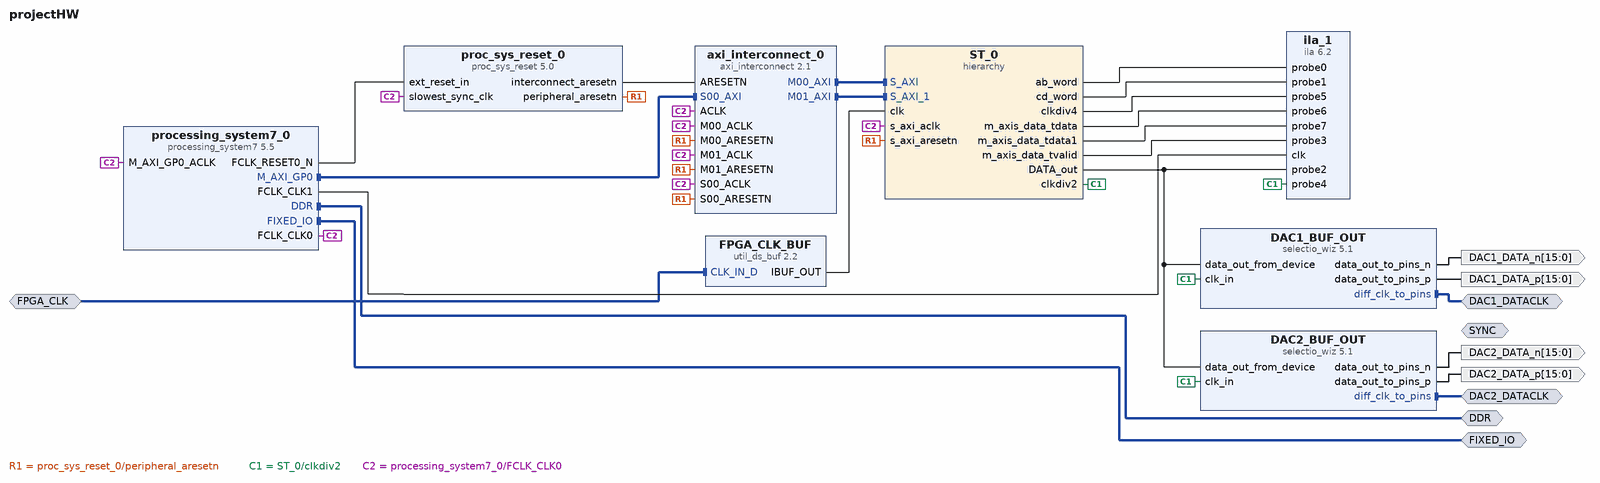
[diagram p0: block diagram of the top level]
# Vivado block design projectHW, xc7z020clg400-1, Vivado 2021.1
create_bd_design projectHW

create_bd_intf_port -mode Master -vlnv xilinx.com:interface:diff_clock_rtl:1.0 DAC1_DATACLK
create_bd_intf_port -mode Master -vlnv xilinx.com:interface:diff_clock_rtl:1.0 DAC2_DATACLK
create_bd_intf_port -mode Master -vlnv xilinx.com:interface:ddrx_rtl:1.0 DDR
create_bd_intf_port -mode Master -vlnv xilinx.com:display_processing_system7:fixedio_rtl:1.0 FIXED_IO
create_bd_intf_port -mode Slave -vlnv xilinx.com:interface:diff_clock_rtl:1.0 FPGA_CLK
create_bd_intf_port -mode Master -vlnv xilinx.com:interface:diff_clock_rtl:1.0 SYNC
create_bd_port -dir O -from 15 -to 0 DAC1_DATA_n
create_bd_port -dir O -from 15 -to 0 DAC1_DATA_p
create_bd_port -dir O -from 15 -to 0 DAC2_DATA_n
create_bd_port -dir O -from 15 -to 0 DAC2_DATA_p

create_bd_cell -type ip -vlnv xilinx.com:ip:selectio_wiz:5.1 DAC1_BUF_OUT
set_property -dict [list \
  CONFIG.BUS_DIR OUTPUTS \
  CONFIG.BUS_IO_STD LVDS_25 \
  CONFIG.BUS_SIG_TYPE DIFF \
  CONFIG.CLK_FWD true \
  CONFIG.CLK_FWD_IO_STD LVDS_25 \
  CONFIG.CLK_FWD_SIG_TYPE DIFF \
  CONFIG.SELIO_ACTIVE_EDGE DDR \
  CONFIG.SELIO_BUS_IN_DELAY NONE \
  CONFIG.SELIO_CLK_BUF MMCM \
  CONFIG.SELIO_CLK_IO_STD LVDS_25 \
  CONFIG.SELIO_CLK_SIG_TYPE DIFF \
  CONFIG.SELIO_INTERFACE_TYPE NETWORKING \
  CONFIG.SERIALIZATION_FACTOR 4 \
  CONFIG.SYSTEM_DATA_WIDTH 16 \
] [get_bd_cells DAC1_BUF_OUT]
create_bd_cell -type ip -vlnv xilinx.com:ip:selectio_wiz:5.1 DAC2_BUF_OUT
set_property -dict [list \
  CONFIG.BUS_DIR OUTPUTS \
  CONFIG.BUS_IO_STD LVDS_25 \
  CONFIG.BUS_SIG_TYPE DIFF \
  CONFIG.CLK_FWD true \
  CONFIG.CLK_FWD_IO_STD LVDS_25 \
  CONFIG.CLK_FWD_SIG_TYPE DIFF \
  CONFIG.CONFIG_CLK_FWD true \
  CONFIG.SELIO_ACTIVE_EDGE DDR \
  CONFIG.SELIO_BUS_IN_DELAY NONE \
  CONFIG.SELIO_CLK_BUF MMCM \
  CONFIG.SELIO_CLK_IO_STD LVDS_25 \
  CONFIG.SELIO_CLK_SIG_TYPE DIFF \
  CONFIG.SELIO_INTERFACE_TYPE NETWORKING \
  CONFIG.SERIALIZATION_FACTOR 4 \
  CONFIG.SYSTEM_DATA_WIDTH 16 \
] [get_bd_cells DAC2_BUF_OUT]
create_bd_cell -type ip -vlnv xilinx.com:ip:util_ds_buf:2.2 FPGA_CLK_BUF
create_bd_cell -type hier ST_0
create_bd_cell -type ip -vlnv xilinx.com:ip:axi_interconnect:2.1 axi_interconnect_0
set_property -dict {CONFIG.NUM_MI 2} [get_bd_cells axi_interconnect_0]
create_bd_cell -type ip -vlnv xilinx.com:ip:ila:6.2 ila_1
set_property -dict [list \
  CONFIG.ALL_PROBE_SAME_MU false \
  CONFIG.C_DATA_DEPTH 8192 \
  CONFIG.C_ENABLE_ILA_AXI_MON false \
  CONFIG.C_MONITOR_TYPE Native \
  CONFIG.C_NUM_OF_PROBES 8 \
  CONFIG.C_PROBE0_WIDTH 64 \
  CONFIG.C_PROBE1_WIDTH 64 \
  CONFIG.C_PROBE2_WIDTH 32 \
  CONFIG.C_PROBE4_WIDTH 1 \
  CONFIG.C_PROBE6_WIDTH 32 \
  CONFIG.C_PROBE7_WIDTH 32 \
] [get_bd_cells ila_1]
create_bd_cell -type ip -vlnv xilinx.com:ip:proc_sys_reset:5.0 proc_sys_reset_0
create_bd_cell -type ip -vlnv xilinx.com:ip:processing_system7:5.5 processing_system7_0
set_property -dict [list \
  CONFIG.PCW_APU_PERIPHERAL_FREQMHZ 666.666666 \
  CONFIG.PCW_ENET0_ENET0_IO {MIO 16 .. 27} \
  CONFIG.PCW_ENET0_GRP_MDIO_ENABLE 1 \
  CONFIG.PCW_ENET0_GRP_MDIO_IO {MIO 52 .. 53} \
  CONFIG.PCW_ENET0_PERIPHERAL_ENABLE 1 \
  CONFIG.PCW_ENET_RESET_ENABLE 0 \
  CONFIG.PCW_EN_CLK1_PORT 1 \
  CONFIG.PCW_FPGA0_PERIPHERAL_FREQMHZ 125 \
  CONFIG.PCW_FPGA1_PERIPHERAL_FREQMHZ 250 \
  CONFIG.PCW_FPGA_FCLK1_ENABLE 1 \
  CONFIG.PCW_GPIO_MIO_GPIO_ENABLE 1 \
  CONFIG.PCW_GPIO_MIO_GPIO_IO MIO \
  CONFIG.PCW_I2C_RESET_ENABLE 0 \
  CONFIG.PCW_PERIPHERAL_BOARD_PRESET part0 \
  CONFIG.PCW_PRESET_BANK1_VOLTAGE {LVCMOS 2.5V} \
  CONFIG.PCW_QSPI_GRP_FBCLK_ENABLE 1 \
  CONFIG.PCW_QSPI_GRP_FBCLK_IO {MIO 8} \
  CONFIG.PCW_QSPI_GRP_SINGLE_SS_ENABLE 1 \
  CONFIG.PCW_QSPI_GRP_SINGLE_SS_IO {MIO 1 .. 6} \
  CONFIG.PCW_QSPI_PERIPHERAL_ENABLE 1 \
  CONFIG.PCW_QSPI_QSPI_IO {MIO 1 .. 6} \
  CONFIG.PCW_SD0_GRP_CD_ENABLE 1 \
  CONFIG.PCW_SD0_GRP_CD_IO {MIO 46} \
  CONFIG.PCW_SD0_GRP_WP_ENABLE 1 \
  CONFIG.PCW_SD0_GRP_WP_IO {MIO 50} \
  CONFIG.PCW_SD0_PERIPHERAL_ENABLE 1 \
  CONFIG.PCW_SD0_SD0_IO {MIO 40 .. 45} \
  CONFIG.PCW_SDIO_PERIPHERAL_FREQMHZ 100 \
  CONFIG.PCW_SINGLE_QSPI_DATA_MODE x4 \
  CONFIG.PCW_UART1_PERIPHERAL_ENABLE 1 \
  CONFIG.PCW_UART1_UART1_IO {MIO 48 .. 49} \
  CONFIG.PCW_UART_PERIPHERAL_FREQMHZ 100 \
  CONFIG.PCW_UIPARAM_DDR_FREQ_MHZ 533.333333 \
  CONFIG.PCW_UIPARAM_DDR_PARTNO {MT41K256M16 RE-125} \
  CONFIG.PCW_USB0_PERIPHERAL_ENABLE 1 \
  CONFIG.PCW_USB0_USB0_IO {MIO 28 .. 39} \
  CONFIG.PCW_USB_RESET_ENABLE 0 \
] [get_bd_cells processing_system7_0]
# 499 more settings of processing_system7_0 are not shown: defaults, MIO pin electricals, DDR timing, and values the tool derives

# ---- hierarchy /ST_0 ----
current_bd_instance /ST_0
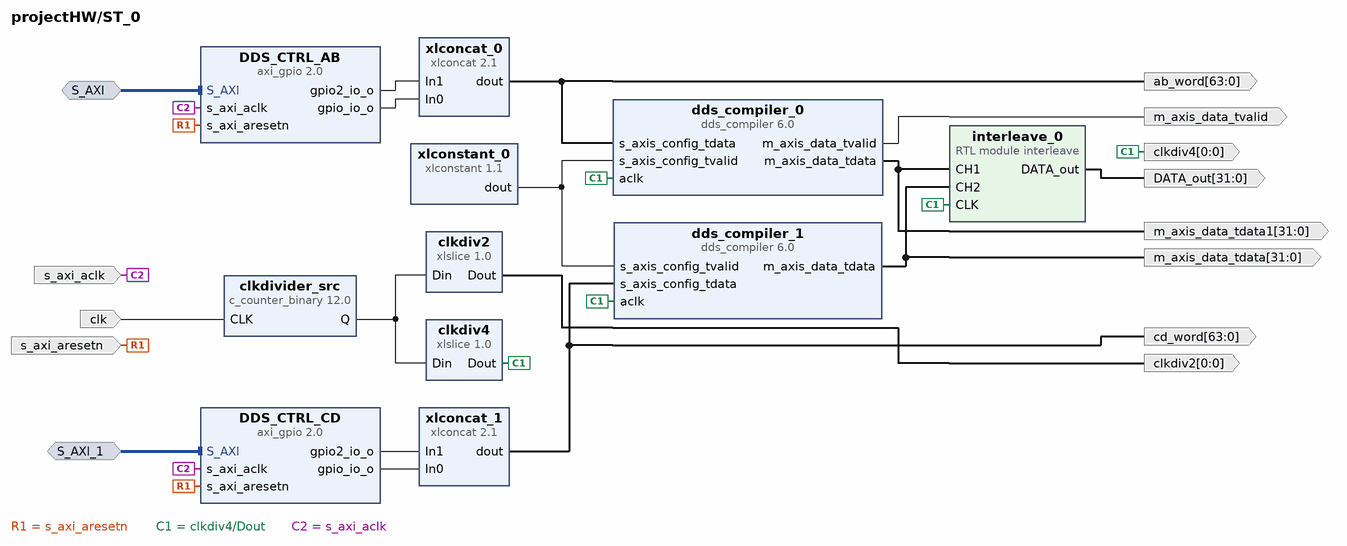
[diagram p1: block diagram inside /ST_0]
create_bd_intf_pin -mode Slave -vlnv xilinx.com:interface:aximm_rtl:1.0 S_AXI
create_bd_intf_pin -mode Slave -vlnv xilinx.com:interface:aximm_rtl:1.0 S_AXI_1
create_bd_pin -dir I -type clk s_axi_aclk
create_bd_pin -dir I -type rst s_axi_aresetn
create_bd_pin -dir I clk
create_bd_pin -dir O -from 0 -to 0 clkdiv2
create_bd_pin -dir O -from 0 -to 0 clkdiv4
create_bd_pin -dir O m_axis_data_tvalid
create_bd_pin -dir O -from 63 -to 0 cd_word
create_bd_pin -dir O -from 63 -to 0 ab_word
create_bd_pin -dir O -from 31 -to 0 DATA_out
create_bd_pin -dir O -from 31 -to 0 m_axis_data_tdata
create_bd_pin -dir O -from 31 -to 0 m_axis_data_tdata1

create_bd_cell -type ip -vlnv xilinx.com:ip:axi_gpio:2.0 DDS_CTRL_AB
set_property -dict [list \
  CONFIG.C_ALL_OUTPUTS 1 \
  CONFIG.C_ALL_OUTPUTS_2 1 \
  CONFIG.C_GPIO2_WIDTH 32 \
  CONFIG.C_IS_DUAL 1 \
] [get_bd_cells DDS_CTRL_AB]
create_bd_cell -type ip -vlnv xilinx.com:ip:dds_compiler:6.0 dds_compiler_0
set_property -dict [list \
  CONFIG.Channels 1 \
  CONFIG.DATA_Has_TLAST Not_Required \
  CONFIG.DDS_Clock_Rate 62.5 \
  CONFIG.Frequency_Resolution 0.4 \
  CONFIG.Has_Phase_Out false \
  CONFIG.Latency 8 \
  CONFIG.M_DATA_Has_TUSER Not_Required \
  CONFIG.M_PHASE_Has_TUSER Not_Required \
  CONFIG.Noise_Shaping None \
  CONFIG.Output_Frequency1 0 \
  CONFIG.Output_Width 16 \
  CONFIG.PINC1 0 \
  CONFIG.Parameter_Entry Hardware_Parameters \
  CONFIG.PartsPresent Phase_Generator_and_SIN_COS_LUT \
  CONFIG.Phase_Increment Programmable \
  CONFIG.Phase_Width 32 \
  CONFIG.Phase_offset Programmable \
  CONFIG.S_PHASE_Has_TUSER Not_Required \
] [get_bd_cells dds_compiler_0]
create_bd_cell -type ip -vlnv xilinx.com:ip:xlconcat:2.1 xlconcat_0
set_property -dict {CONFIG.IN0_WIDTH 32 CONFIG.IN1_WIDTH 32} [get_bd_cells xlconcat_0]
create_bd_cell -type ip -vlnv xilinx.com:ip:axi_gpio:2.0 DDS_CTRL_CD
set_property -dict [list \
  CONFIG.C_ALL_OUTPUTS 1 \
  CONFIG.C_ALL_OUTPUTS_2 1 \
  CONFIG.C_GPIO2_WIDTH 32 \
  CONFIG.C_IS_DUAL 1 \
] [get_bd_cells DDS_CTRL_CD]
create_bd_cell -type ip -vlnv xilinx.com:ip:xlconcat:2.1 xlconcat_1
set_property -dict {CONFIG.IN0_WIDTH 32 CONFIG.IN1_WIDTH 32} [get_bd_cells xlconcat_1]
create_bd_cell -type ip -vlnv xilinx.com:ip:xlconstant:1.1 xlconstant_0
create_bd_cell -type ip -vlnv xilinx.com:ip:c_counter_binary:12.0 clkdivider_src
set_property -dict {CONFIG.Output_Width 2} [get_bd_cells clkdivider_src]
create_bd_cell -type ip -vlnv xilinx.com:ip:xlslice:1.0 clkdiv2
set_property -dict {CONFIG.DIN_FROM 0 CONFIG.DIN_WIDTH 2 CONFIG.DOUT_WIDTH 1} [get_bd_cells clkdiv2]
create_bd_cell -type ip -vlnv xilinx.com:ip:xlslice:1.0 clkdiv4
set_property -dict {CONFIG.DIN_FROM 1 CONFIG.DIN_TO 1 CONFIG.DIN_WIDTH 2 CONFIG.DOUT_WIDTH 1} [get_bd_cells clkdiv4]
create_bd_cell -type ip -vlnv xilinx.com:ip:dds_compiler:6.0 dds_compiler_1
set_property -dict [list \
  CONFIG.Channels 1 \
  CONFIG.DATA_Has_TLAST Not_Required \
  CONFIG.DDS_Clock_Rate 62.5 \
  CONFIG.Frequency_Resolution 0.4 \
  CONFIG.Has_Phase_Out false \
  CONFIG.Latency 8 \
  CONFIG.M_DATA_Has_TUSER Not_Required \
  CONFIG.M_PHASE_Has_TUSER Not_Required \
  CONFIG.Noise_Shaping None \
  CONFIG.Output_Frequency1 0 \
  CONFIG.Output_Width 16 \
  CONFIG.PINC1 0 \
  CONFIG.Parameter_Entry Hardware_Parameters \
  CONFIG.PartsPresent Phase_Generator_and_SIN_COS_LUT \
  CONFIG.Phase_Increment Programmable \
  CONFIG.Phase_Width 32 \
  CONFIG.Phase_offset Programmable \
  CONFIG.S_PHASE_Has_TUSER Not_Required \
] [get_bd_cells dds_compiler_1]
create_bd_cell -type module -reference interleave interleave_0

# ---- connections ----

current_bd_instance /ST_0
connect_bd_intf_net -intf_net S_AXI_1_1 [get_bd_intf_pins S_AXI_1] [get_bd_intf_pins DDS_CTRL_CD/S_AXI]
connect_bd_intf_net -intf_net axi_interconnect_0_M00_AXI [get_bd_intf_pins S_AXI] [get_bd_intf_pins DDS_CTRL_AB/S_AXI]
connect_bd_net -net DAC2_CTRL_gpio2_io_o [get_bd_pins DDS_CTRL_AB/gpio2_io_o] [get_bd_pins xlconcat_0/In1]
connect_bd_net -net DAC2_CTRL_gpio_io_o [get_bd_pins DDS_CTRL_AB/gpio_io_o] [get_bd_pins xlconcat_0/In0]
connect_bd_net -net DDS_CTRL_AB1_gpio2_io_o [get_bd_pins DDS_CTRL_CD/gpio2_io_o] [get_bd_pins xlconcat_1/In1]
connect_bd_net -net DDS_CTRL_AB1_gpio_io_o [get_bd_pins DDS_CTRL_CD/gpio_io_o] [get_bd_pins xlconcat_1/In0]
connect_bd_net -net S00_ARESETN_1 [get_bd_pins s_axi_aresetn] [get_bd_pins DDS_CTRL_AB/s_axi_aresetn] [get_bd_pins DDS_CTRL_CD/s_axi_aresetn]
connect_bd_net [get_bd_pins clk] [get_bd_pins clkdivider_src/CLK]
connect_bd_net [get_bd_pins clkdiv2/Dout] [get_bd_pins clkdiv2]
connect_bd_net [get_bd_pins clkdiv4/Dout] \
  [get_bd_pins dds_compiler_0/aclk] [get_bd_pins dds_compiler_1/aclk] [get_bd_pins interleave_0/CLK] [get_bd_pins clkdiv4]
connect_bd_net [get_bd_pins clkdivider_src/Q] [get_bd_pins clkdiv2/Din] [get_bd_pins clkdiv4/Din]
connect_bd_net [get_bd_pins dds_compiler_0/m_axis_data_tdata] [get_bd_pins interleave_0/CH1] [get_bd_pins m_axis_data_tdata1]
connect_bd_net [get_bd_pins dds_compiler_0/m_axis_data_tvalid] [get_bd_pins m_axis_data_tvalid]
connect_bd_net [get_bd_pins dds_compiler_1/m_axis_data_tdata] [get_bd_pins interleave_0/CH2] [get_bd_pins m_axis_data_tdata]
connect_bd_net [get_bd_pins interleave_0/DATA_out] [get_bd_pins DATA_out]
connect_bd_net -net processing_system7_0_FCLK_CLK0 [get_bd_pins s_axi_aclk] [get_bd_pins DDS_CTRL_AB/s_axi_aclk] [get_bd_pins DDS_CTRL_CD/s_axi_aclk]
connect_bd_net [get_bd_pins xlconcat_0/dout] [get_bd_pins dds_compiler_0/s_axis_config_tdata] [get_bd_pins ab_word]
connect_bd_net [get_bd_pins xlconcat_1/dout] [get_bd_pins dds_compiler_1/s_axis_config_tdata] [get_bd_pins cd_word]
connect_bd_net [get_bd_pins xlconstant_0/dout] [get_bd_pins dds_compiler_0/s_axis_config_tvalid] [get_bd_pins dds_compiler_1/s_axis_config_tvalid]

current_bd_instance /
connect_bd_intf_net [get_bd_intf_ports DAC1_DATACLK] [get_bd_intf_pins DAC1_BUF_OUT/diff_clk_to_pins]
connect_bd_intf_net [get_bd_intf_ports DAC2_DATACLK] [get_bd_intf_pins DAC2_BUF_OUT/diff_clk_to_pins]
connect_bd_intf_net [get_bd_intf_ports FPGA_CLK] [get_bd_intf_pins FPGA_CLK_BUF/CLK_IN_D]
connect_bd_intf_net [get_bd_intf_pins axi_interconnect_0/S00_AXI] [get_bd_intf_pins processing_system7_0/M_AXI_GP0]
connect_bd_intf_net [get_bd_intf_pins ST_0/S_AXI] [get_bd_intf_pins axi_interconnect_0/M00_AXI]
connect_bd_intf_net [get_bd_intf_pins axi_interconnect_0/M01_AXI] [get_bd_intf_pins ST_0/S_AXI_1]
connect_bd_intf_net [get_bd_intf_ports DDR] [get_bd_intf_pins processing_system7_0/DDR]
connect_bd_intf_net [get_bd_intf_ports FIXED_IO] [get_bd_intf_pins processing_system7_0/FIXED_IO]
connect_bd_net [get_bd_pins DAC1_BUF_OUT/data_out_to_pins_n] [get_bd_ports DAC1_DATA_n]
connect_bd_net [get_bd_pins DAC1_BUF_OUT/data_out_to_pins_p] [get_bd_ports DAC1_DATA_p]
connect_bd_net [get_bd_pins DAC2_BUF_OUT/data_out_to_pins_n] [get_bd_ports DAC2_DATA_n]
connect_bd_net [get_bd_pins DAC2_BUF_OUT/data_out_to_pins_p] [get_bd_ports DAC2_DATA_p]
connect_bd_net [get_bd_pins FPGA_CLK_BUF/IBUF_OUT] [get_bd_pins ST_0/clk]
connect_bd_net -net S00_ARESETN_1 [get_bd_pins proc_sys_reset_0/peripheral_aresetn] \
  [get_bd_pins ST_0/s_axi_aresetn] [get_bd_pins axi_interconnect_0/M00_ARESETN] [get_bd_pins axi_interconnect_0/S00_ARESETN] \
  [get_bd_pins axi_interconnect_0/M01_ARESETN]
connect_bd_net [get_bd_pins ST_0/DATA_out] \
  [get_bd_pins ila_1/probe2] [get_bd_pins DAC1_BUF_OUT/data_out_from_device] [get_bd_pins DAC2_BUF_OUT/data_out_from_device]
connect_bd_net [get_bd_pins ST_0/ab_word] [get_bd_pins ila_1/probe0]
connect_bd_net [get_bd_pins ST_0/cd_word] [get_bd_pins ila_1/probe1]
connect_bd_net [get_bd_pins ST_0/clkdiv2] [get_bd_pins ila_1/probe4] [get_bd_pins DAC2_BUF_OUT/clk_in] [get_bd_pins DAC1_BUF_OUT/clk_in]
connect_bd_net [get_bd_pins ST_0/clkdiv4] [get_bd_pins ila_1/probe5]
connect_bd_net [get_bd_pins ST_0/m_axis_data_tdata] [get_bd_pins ila_1/probe6]
connect_bd_net [get_bd_pins ST_0/m_axis_data_tdata1] [get_bd_pins ila_1/probe7]
connect_bd_net [get_bd_pins ST_0/m_axis_data_tvalid] [get_bd_pins ila_1/probe3]
connect_bd_net [get_bd_pins proc_sys_reset_0/interconnect_aresetn] [get_bd_pins axi_interconnect_0/ARESETN]
connect_bd_net [get_bd_pins processing_system7_0/FCLK_CLK0] \
  [get_bd_pins ST_0/s_axi_aclk] [get_bd_pins axi_interconnect_0/ACLK] [get_bd_pins axi_interconnect_0/M00_ACLK] \
  [get_bd_pins axi_interconnect_0/S00_ACLK] [get_bd_pins proc_sys_reset_0/slowest_sync_clk] \
  [get_bd_pins processing_system7_0/M_AXI_GP0_ACLK] [get_bd_pins axi_interconnect_0/M01_ACLK]
connect_bd_net [get_bd_pins processing_system7_0/FCLK_CLK1] [get_bd_pins ila_1/clk]
connect_bd_net [get_bd_pins processing_system7_0/FCLK_RESET0_N] [get_bd_pins proc_sys_reset_0/ext_reset_in]

# ---- address map ----
assign_bd_address -offset 0x41200000 -range 64K -target_address_space [get_bd_addr_spaces processing_system7_0/Data] [get_bd_addr_segs ST_0/DDS_CTRL_AB/S_AXI/Reg]
assign_bd_address -offset 0x41210000 -range 64K -target_address_space [get_bd_addr_spaces processing_system7_0/Data] [get_bd_addr_segs ST_0/DDS_CTRL_CD/S_AXI/Reg]

validate_bd_design
save_bd_design
